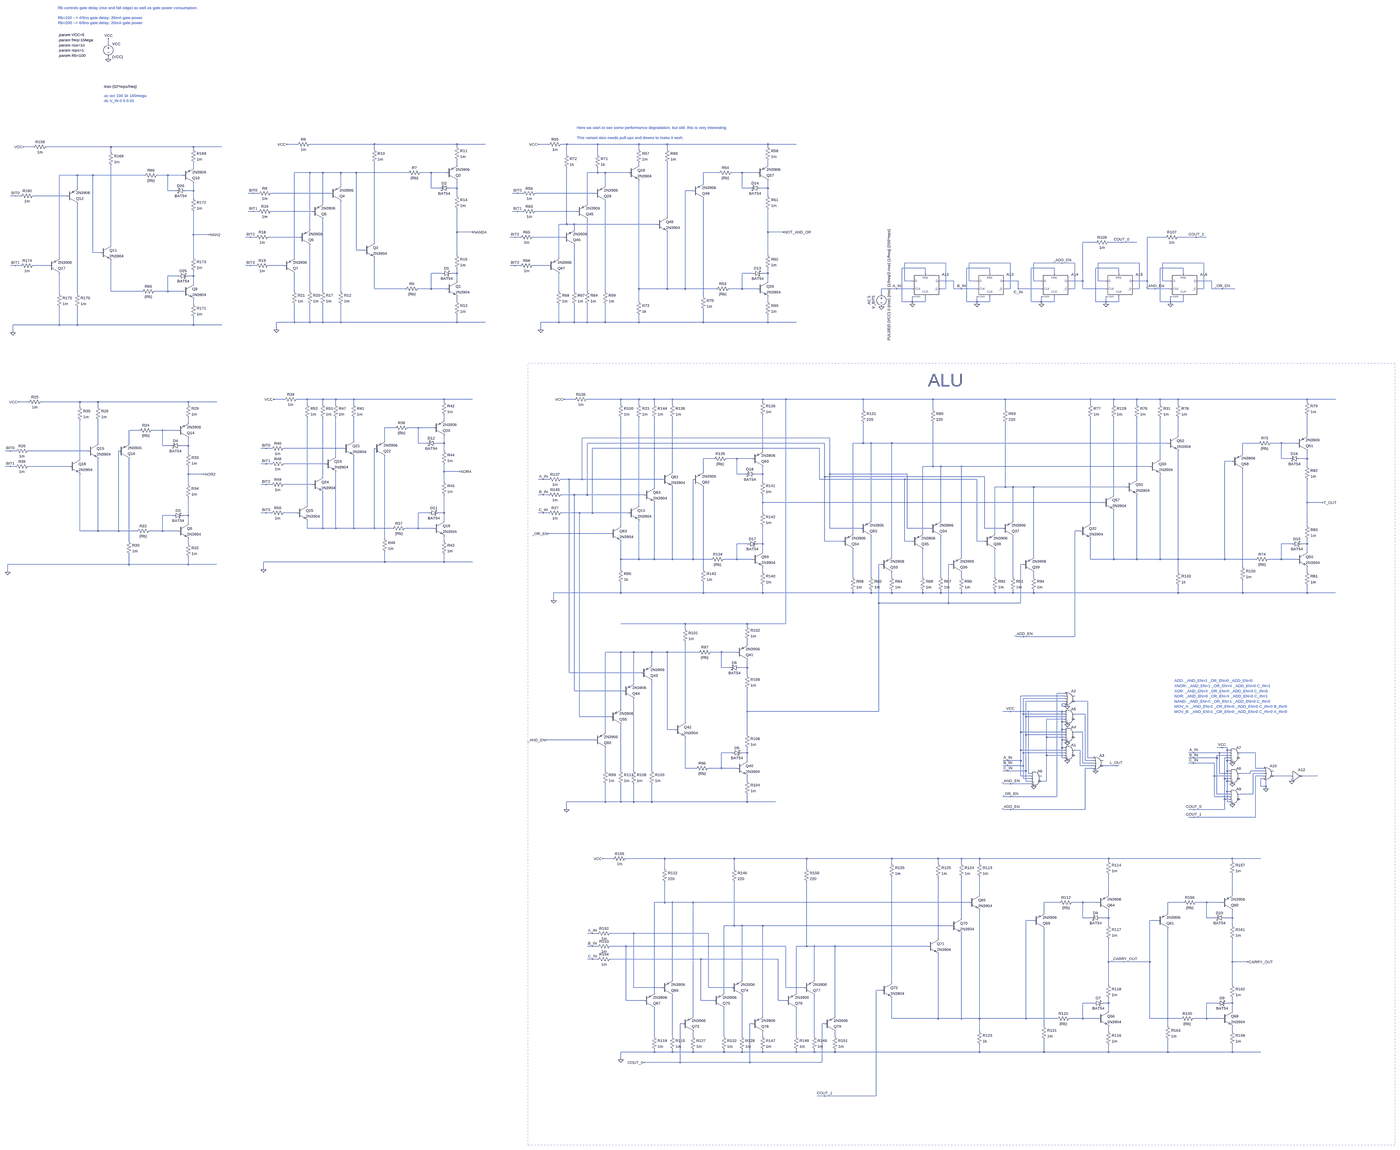
[diagram p0: schematic adder.asc, whole sheet]
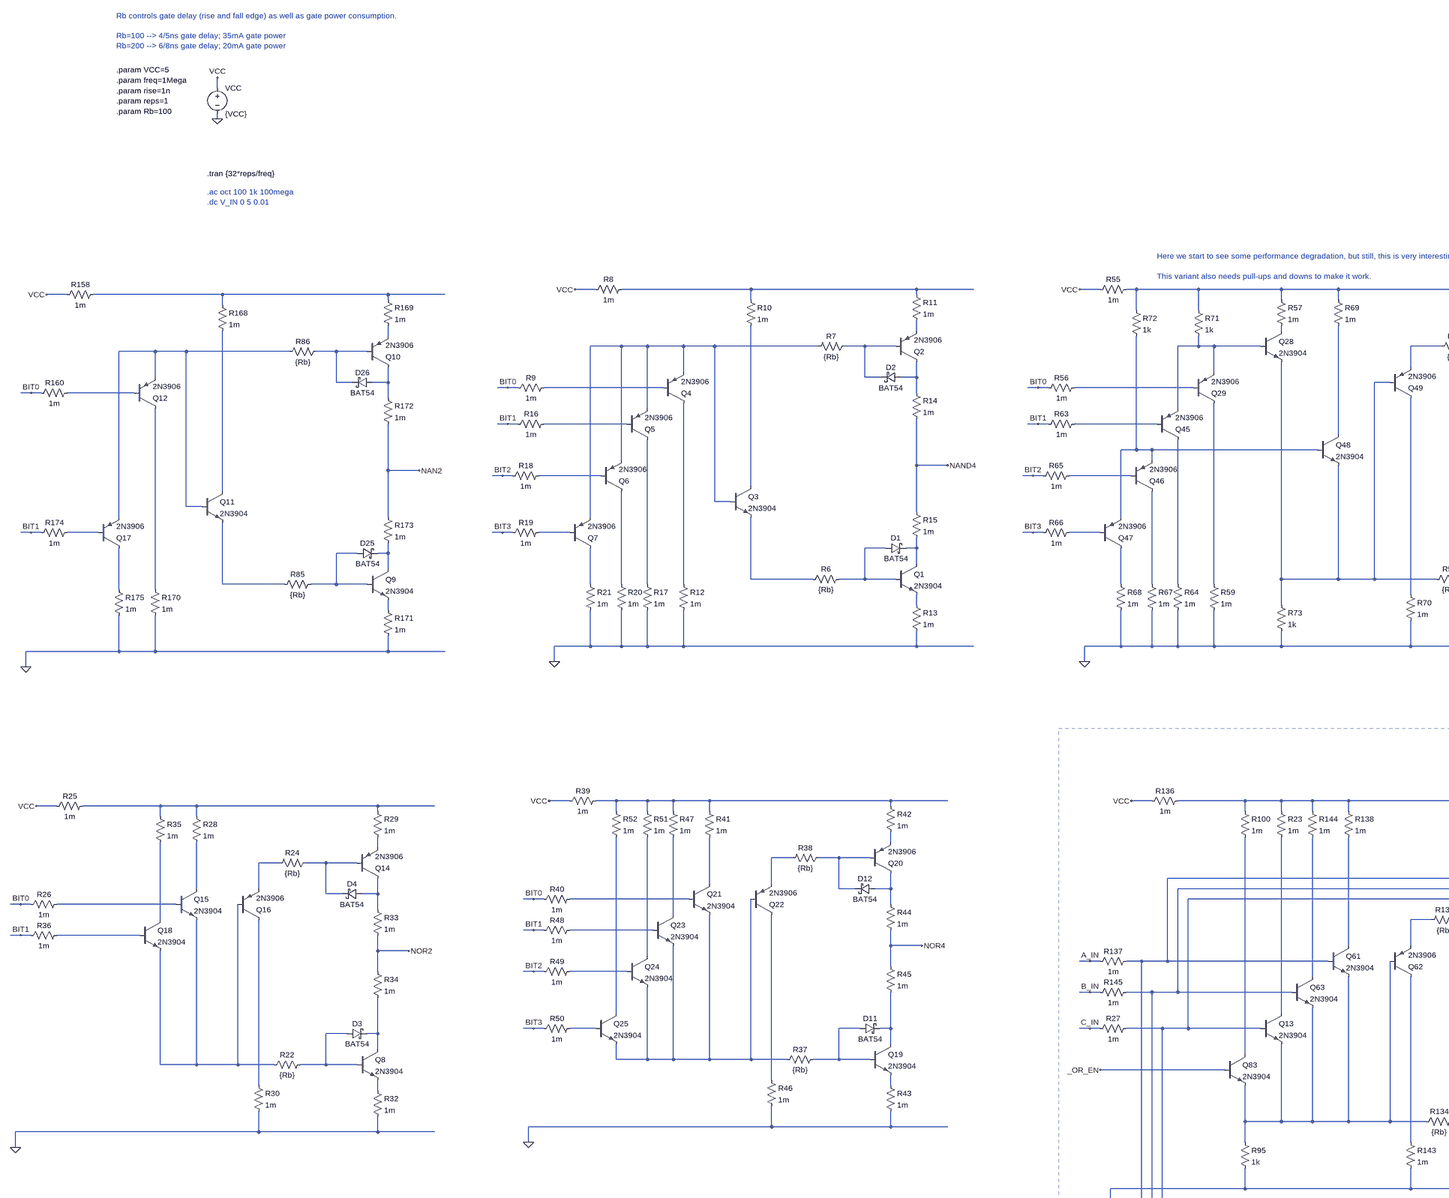
[diagram p1: schematic adder.asc, part, row 1 of 2, column 1 of 2]
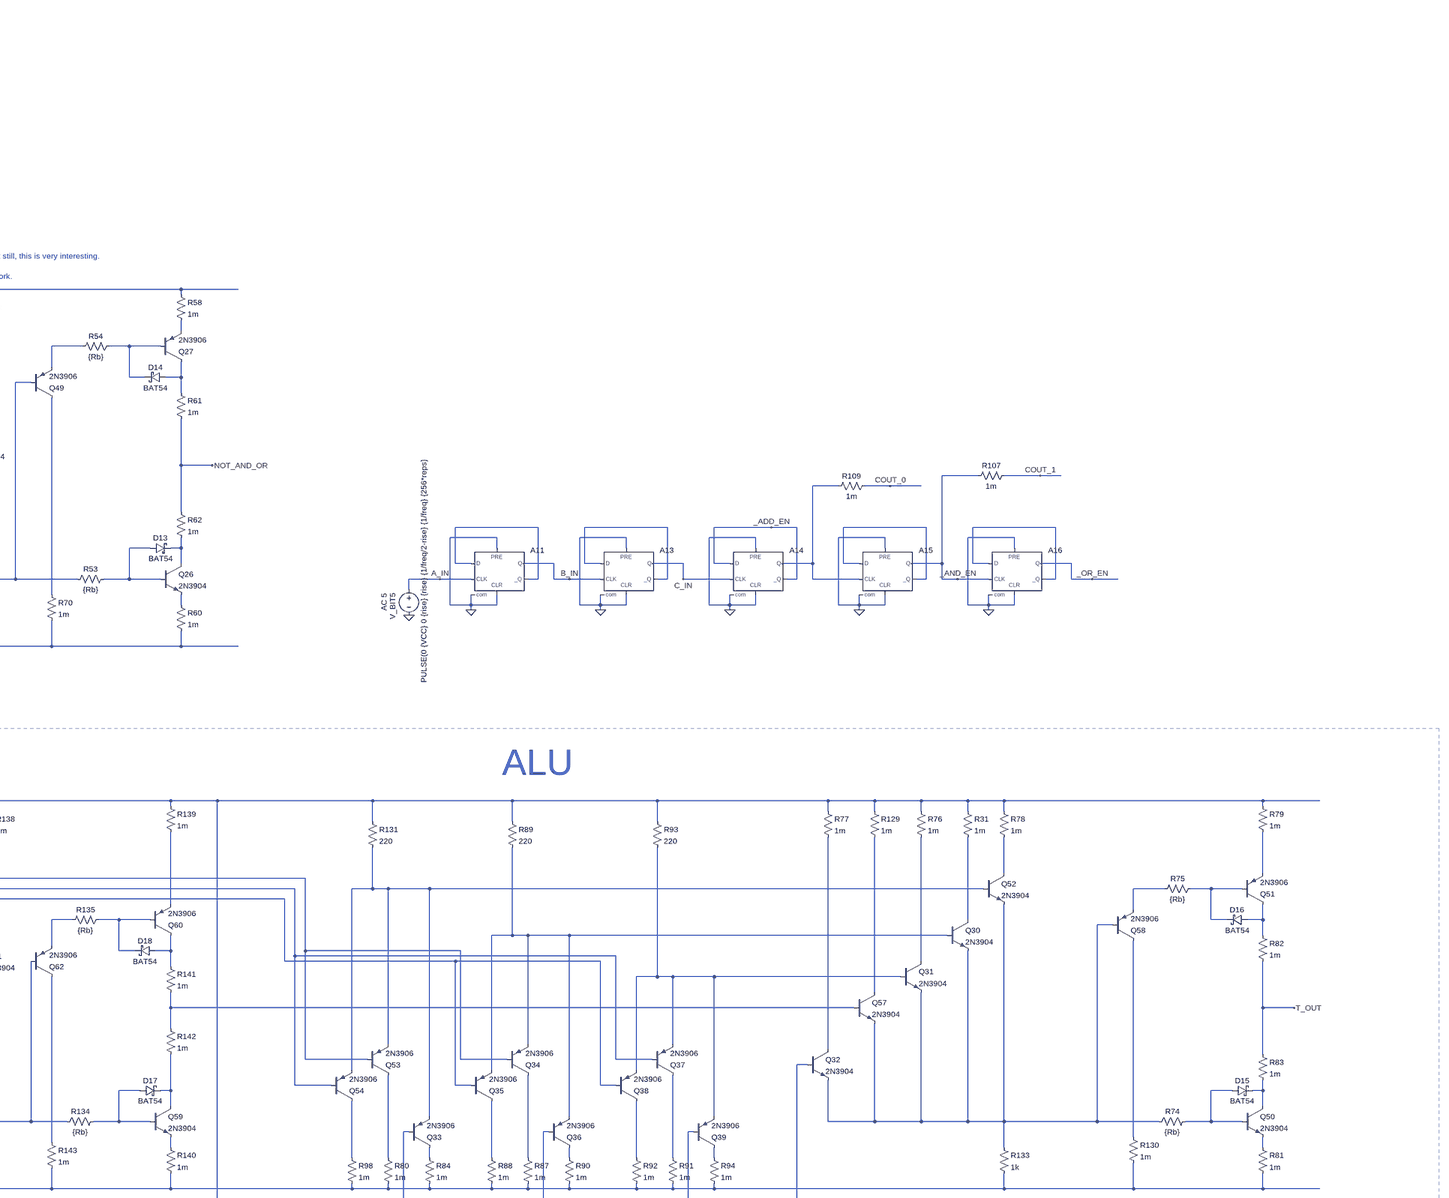
[diagram p2: schematic adder.asc, part, row 1 of 2, column 2 of 2]
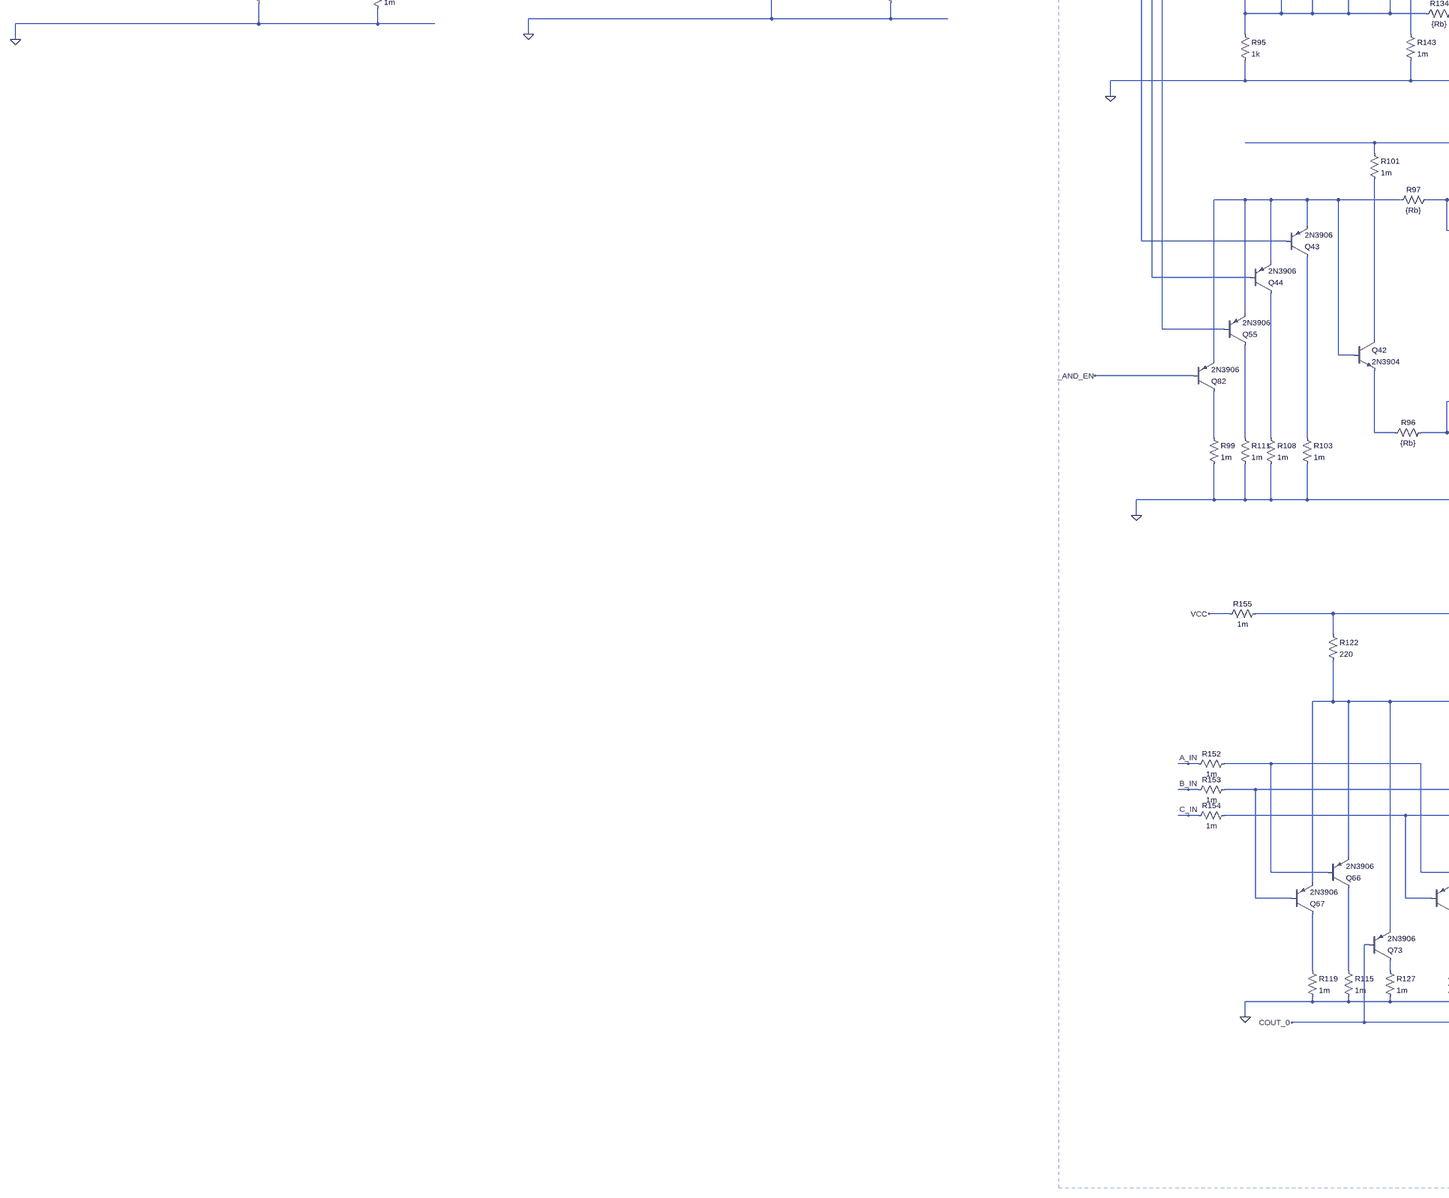
[diagram p3: schematic adder.asc, part, row 2 of 2, column 1 of 2]
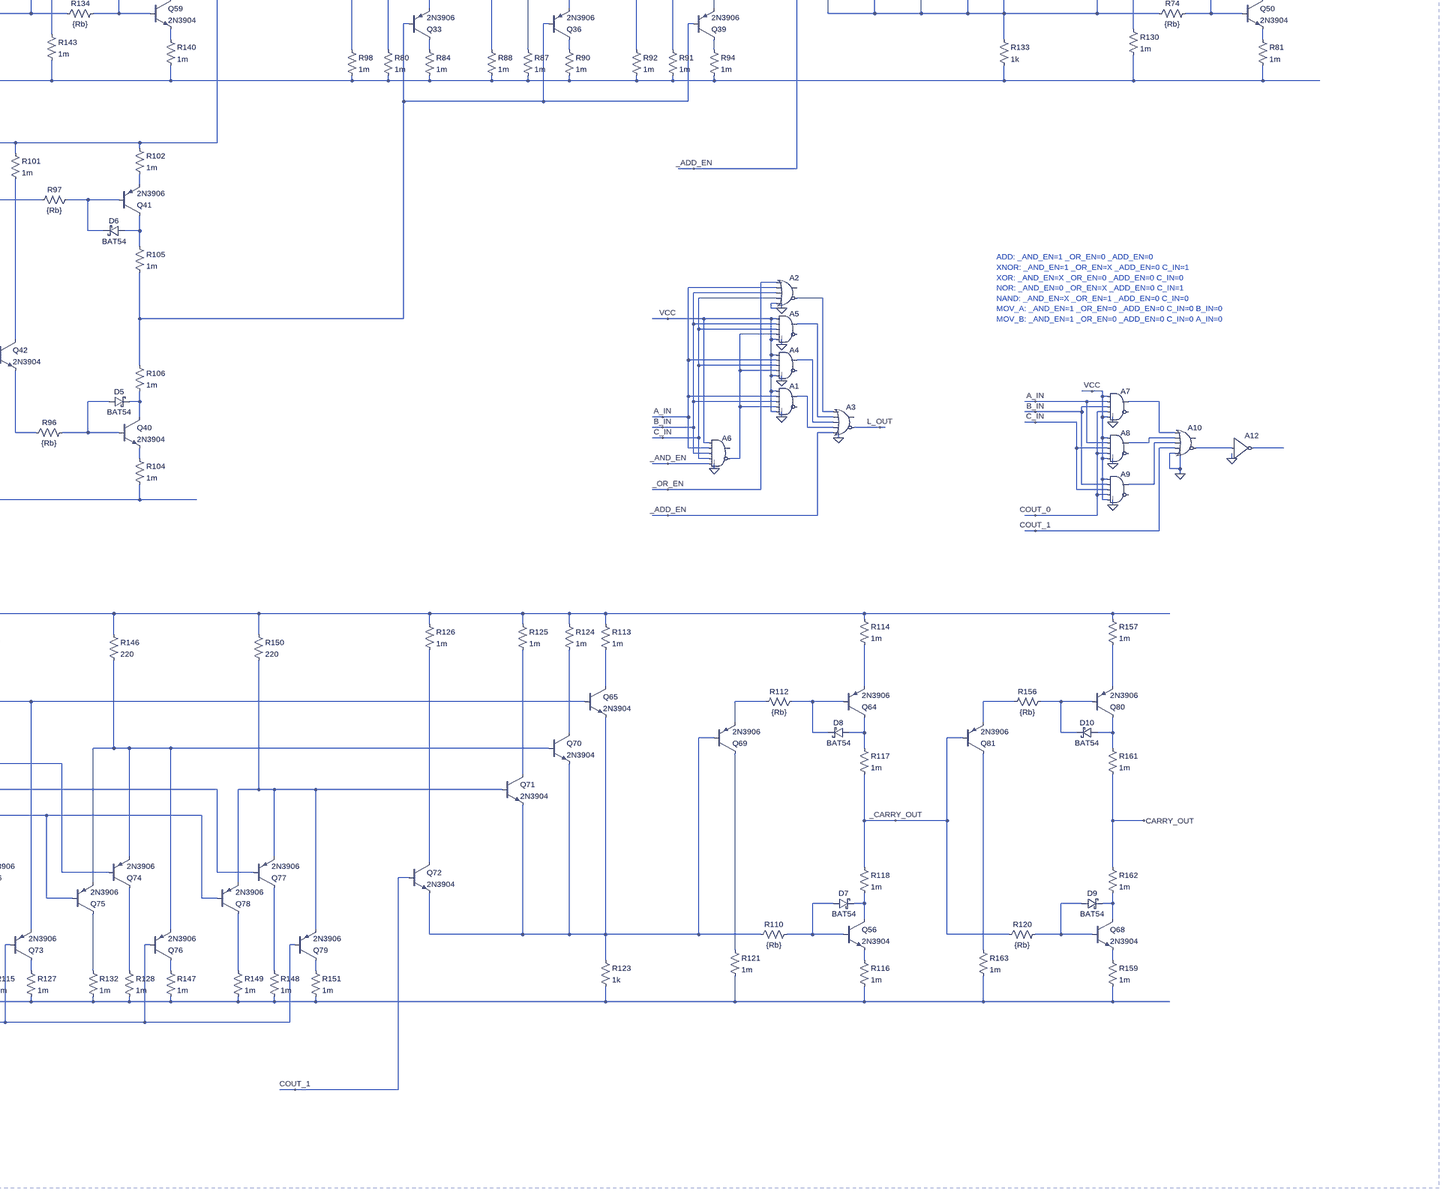
[diagram p4: schematic adder.asc, part, row 2 of 2, column 2 of 2]
* adder.asc
VCC VCC 0 {VCC}
R85 N045 N042 {Rb}
Q9 N043 N042 N059 0 2N3904
D25 N042 N043 BAT54
Q10 N017 N014 N007 0 2N3906
D26 N017 N014 BAT54
R86 N014 N013 {Rb}
R158 VCC N003 1m
R160 BIT0 N021 1m
Q11 N030 N013 N045 0 2N3904
Q12 N055 N021 N013 0 2N3906
R168 N003 N030 1m
R169 N003 N007 1m
R170 N055 0 1m
R171 N059 0 1m
R172 N017 NAN2 1m
R173 NAN2 N043 1m
Q17 N054 N035 N013 0 2N3906
R174 BIT1 N035 1m
R175 N054 0 1m
R6 N044 N038 {Rb}
Q1 N039 N038 N057 0 2N3904
D1 N038 N039 BAT54
Q2 N015 N009 N004 0 2N3906
D2 N015 N009 BAT54
R7 N009 N008 {Rb}
R8 VCC N001 1m
R9 BIT0 N019 1m
Q3 N028 N008 N044 0 2N3904
Q4 N049 N019 N008 0 2N3906
R10 N001 N028 1m
R11 N001 N004 1m
R12 N049 0 1m
R13 N057 0 1m
R14 N015 NAND4 1m
R15 NAND4 N039 1m
Q5 N048 N022 N008 0 2N3906
R16 BIT1 N022 1m
R17 N048 0 1m
Q6 N047 N026 N008 0 2N3906
R18 BIT2 N026 1m
Q7 N046 N036 N008 0 2N3906
R19 BIT3 N036 1m
R20 N047 0 1m
R21 N046 0 1m
R22 N113 N108 {Rb}
Q8 N109 N108 N117 0 2N3904
D3 N108 N109 BAT54
Q14 N079 N068 N064 0 2N3906
D4 N079 N068 BAT54
R24 N068 N067 {Rb}
R25 VCC N062 1m
R26 BIT0 N082 1m
Q15 N073 N082 N113 0 2N3904
Q16 N115 N113 N067 0 2N3906
R28 N062 N073 1m
R29 N062 N064 1m
R32 N117 0 1m
R33 N079 NOR2 1m
R34 NOR2 N109 1m
R30 N115 0 1m
Q18 N085 N092 N113 0 2N3904
R35 N062 N085 1m
R36 BIT1 N092 1m
R37 N112 N106 {Rb}
Q19 N107 N106 N116 0 2N3904
D11 N106 N107 BAT54
Q20 N074 N066 N063 0 2N3906
D12 N074 N066 BAT54
R38 N066 N065 {Rb}
R39 VCC N060 1m
R40 BIT0 N080 1m
Q21 N072 N080 N112 0 2N3904
Q22 N114 N112 N065 0 2N3906
R41 N060 N072 1m
R42 N060 N063 1m
R43 N116 0 1m
R44 N074 NOR4 1m
R45 NOR4 N107 1m
R46 N114 0 1m
Q23 N084 N091 N112 0 2N3904
R47 N060 N084 1m
R48 BIT1 N091 1m
Q24 N096 N098 N112 0 2N3904
R49 BIT2 N098 1m
Q25 N103 N105 N112 0 2N3904
R50 BIT3 N105 1m
R51 N060 N096 1m
R52 N060 N103 1m
R53 N018 N040 {Rb}
Q26 N041 N040 N058 0 2N3904
D13 N040 N041 BAT54
Q27 N016 N012 N006 0 2N3906
D14 N016 N012 BAT54
R54 N012 N011 {Rb}
R55 VCC N002 1m
R56 BIT0 N020 1m
Q28 N005 N010 N018 0 2N3904
Q29 N053 N020 N010 0 2N3906
R57 N002 N005 1m
R58 N002 N006 1m
R59 N053 0 1m
R60 N058 0 1m
R61 N016 NOT_AND_OR 1m
R62 NOT_AND_OR N041 1m
Q45 N052 N023 N010 0 2N3906
R63 BIT1 N023 1m
R64 N052 0 1m
Q46 N051 N027 N025 0 2N3906
R65 BIT2 N027 1m
Q47 N050 N037 N025 0 2N3906
R66 BIT3 N037 1m
R67 N051 0 1m
R68 N050 0 1m
R69 N002 N024 1m
Q48 N024 N025 N018 0 2N3904
Q49 N056 N018 N011 0 2N3906
R70 N056 0 1m
R71 N002 N010 1k
R72 N002 N025 1k
R73 N018 0 1k
R74 N090 N120 {Rb}
Q50 N121 N120 N127 0 2N3904
D15 N120 N121 BAT54
Q51 N089 N078 N070 0 2N3906
D16 N089 N078 BAT54
R75 N078 N077 {Rb}
Q52 N069 N076 N090 0 2N3904
Q53 N129 N071 N076 0 2N3906
R78 N061 N069 1m
R79 N061 N070 1m
R80 N129 0 1m
R81 N127 0 1m
R82 N089 T_OUT 1m
R83 T_OUT N121 1m
Q54 N128 N075 N076 0 2N3906
R98 N128 0 1m
R129 N061 N101 1m
Q57 N101 N102 N090 0 2N3904
Q58 N124 N090 N077 0 2N3906
R130 N124 0 1m
R131 N061 N076 220
R133 N090 0 1k
R134 N122 N118 {Rb}
Q59 N119 N118 N126 0 2N3904
D17 N118 N119 BAT54
Q60 N095 N087 N083 0 2N3906
D18 N095 N087 BAT54
R135 N087 N086 {Rb}
R136 VCC N061 1m
R137 A_IN N071 1m
Q61 N094 N071 N122 0 2N3904
Q62 N125 N122 N086 0 2N3906
R138 N061 N094 1m
R139 N061 N083 1m
R140 N126 0 1m
R141 N095 N102 1m
R142 N102 N119 1m
R143 N125 0 1m
Q63 N099 N075 N122 0 2N3904
R144 N061 N099 1m
R145 B_IN N075 1m
Q13 N104 N081 N122 0 2N3904
R23 N061 N104 1m
R27 C_IN N081 1m
Q30 N088 N093 N090 0 2N3904
Q31 N097 N100 N090 0 2N3904
Q32 N110 _ADD_EN N090 0 2N3904
R31 N061 N088 1m
R76 N061 N097 1m
R77 N061 N110 1m
Q33 N130 N123 N076 0 2N3906
R84 N130 0 1m
Q34 N132 N071 N093 0 2N3906
R87 N132 0 1m
Q35 N131 N081 N093 0 2N3906
R88 N131 0 1m
R89 N061 N093 220
Q36 N133 N123 N093 0 2N3906
R90 N133 0 1m
Q37 N135 N075 N100 0 2N3906
R91 N135 0 1m
Q38 N134 N081 N100 0 2N3906
R92 N134 0 1m
R93 N061 N100 220
Q39 N136 N123 N100 0 2N3906
R94 N136 0 1m
R95 N122 0 1k
R96 N150 N147 {Rb}
Q40 N148 N147 N159 0 2N3904
D5 N147 N148 BAT54
Q41 N140 N139 N137 0 2N3906
D6 N140 N139 BAT54
R97 N139 N138 {Rb}
Q42 N144 N138 N150 0 2N3904
Q43 N154 N071 N138 0 2N3906
R101 N061 N144 1m
R102 N061 N137 1m
R103 N154 0 1m
R104 N159 0 1m
R105 N140 N123 1m
R106 N123 N148 1m
Q44 N153 N075 N138 0 2N3906
R108 N153 0 1m
Q55 N152 N081 N138 0 2N3906
R111 N152 0 1m
R110 N172 N180 {Rb}
Q56 N181 N180 N186 0 2N3904
D7 N180 N181 BAT54
Q64 N170 N166 N162 0 2N3906
D8 N170 N166 BAT54
R112 N166 N165 {Rb}
Q65 N161 N164 N172 0 2N3904
Q66 N189 N174 N164 0 2N3906
R113 N160 N161 1m
R114 N160 N162 1m
R115 N189 0 1m
R116 N186 0 1m
R117 N170 _CARRY_OUT 1m
R118 _CARRY_OUT N181 1m
Q67 N188 N176 N164 0 2N3906
R119 N188 0 1m
Q69 N184 N172 N165 0 2N3906
R121 N184 0 1m
R122 N160 N164 220
R123 N172 0 1k
Q70 N169 N173 N172 0 2N3904
Q71 N175 N177 N172 0 2N3904
Q72 N179 COUT_1 N172 0 2N3904
R124 N160 N169 1m
R125 N160 N175 1m
R126 N160 N179 1m
Q73 N190 COUT_0 N164 0 2N3906
R127 N190 0 1m
Q74 N192 N174 N173 0 2N3906
R128 N192 0 1m
Q75 N191 N178 N173 0 2N3906
R132 N191 0 1m
R146 N160 N173 220
Q76 N193 COUT_0 N173 0 2N3906
R147 N193 0 1m
Q77 N195 N176 N177 0 2N3906
R148 N195 0 1m
Q78 N194 N178 N177 0 2N3906
R149 N194 0 1m
R150 N160 N177 220
Q79 N196 COUT_0 N177 0 2N3906
R151 N196 0 1m
R152 A_IN N174 1m
R153 B_IN N176 1m
R154 C_IN N178 1m
R155 VCC N160 1m
R120 _CARRY_OUT N182 {Rb}
Q68 N183 N182 N187 0 2N3904
D9 N182 N183 BAT54
Q80 N171 N168 N163 0 2N3906
D10 N171 N168 BAT54
R156 N168 N167 {Rb}
R157 N160 N163 1m
R159 N187 0 1m
R161 N171 CARRY_OUT 1m
R162 CARRY_OUT N183 1m
Q81 N185 _CARRY_OUT N167 0 2N3906
R163 N185 0 1m
A1 VCC A_IN B_IN N143 VCC 0 N146 0 AND Vhigh={VCC}
A3 N141 N142 N145 N146 _ADD_EN L_OUT 0 0 OR Vhigh={VCC}
A4 VCC A_IN C_IN N143 VCC 0 N145 0 AND Vhigh={VCC}
A5 VCC B_IN C_IN N143 VCC 0 N142 0 AND Vhigh={VCC}
A2 _OR_EN A_IN B_IN C_IN 0 N141 0 0 OR Vhigh={VCC}
A6 VCC A_IN B_IN C_IN _AND_EN N143 0 0 AND Vhigh={VCC}
A7 VCC A_IN B_IN COUT_0 VCC 0 N149 0 AND Vhigh={VCC}
A8 VCC A_IN C_IN COUT_0 VCC 0 N155 0 AND Vhigh={VCC}
A9 VCC B_IN C_IN COUT_0 VCC 0 N156 0 AND Vhigh={VCC}
A10 N149 N155 N156 COUT_1 0 N157 0 0 OR Vhigh={VCC}
A12 N157 0 0 0 0 N158 0 0 BUF Vhigh={VCC}
V_BIT5 A_IN 0 PULSE(0 {VCC} 0 {rise} {rise} {1/freq/2-rise} {1/freq} {256*reps}) AC 5
A11 N031 0 A_IN 0 0 N031 B_IN 0 DFLOP Vhigh={VCC}
A13 N032 0 B_IN 0 0 N032 C_IN 0 DFLOP Vhigh={VCC}
A15 N033 0 N029 0 0 N033 _AND_EN 0 DFLOP Vhigh={VCC}
A16 N034 0 _AND_EN 0 0 N034 _OR_EN 0 DFLOP Vhigh={VCC}
A14 _ADD_EN 0 C_IN 0 0 _ADD_EN N029 0 DFLOP Vhigh={VCC}
Q82 N151 _AND_EN N138 0 2N3906
R99 N151 0 1m
Q83 N111 _OR_EN N122 0 2N3904
R100 N061 N111 1m
R107 COUT_1 _AND_EN 1m
R109 COUT_0 N029 1m
.model D D
.lib standard.dio
.model NPN NPN
.model PNP PNP
.lib standard.bjt
.tran {32*reps/freq}
* .ac oct 100 1k 100mega
* .dc V_IN 0 5 0.01
.param VCC=5
.param freq=1Mega
.param rise=1n
.param reps=1
.param Rb=100
* Rb controls gate delay (rise and fall edge) as well as gate power consumption.
* Rb=100 --> 4/5ns gate delay; 35mA gate power
* Rb=200 --> 6/8ns gate delay; 20mA gate power
* Here we start to see some performance degradation, but still, this is very interesting.
* This variant also needs pull-ups and downs to make it work.
* ALU
* ADD: _AND_EN=1 _OR_EN=0 _ADD_EN=0
* XNOR: _AND_EN=1 _OR_EN=X _ADD_EN=0 C_IN=1
* XOR: _AND_EN=X _OR_EN=0 _ADD_EN=0 C_IN=0
* NOR: _AND_EN=0 _OR_EN=X _ADD_EN=0 C_IN=1
* NAND: _AND_EN=X _OR_EN=1 _ADD_EN=0 C_IN=0
* MOV_A: _AND_EN=1 _OR_EN=0 _ADD_EN=0 C_IN=0 B_IN=0
* MOV_B: _AND_EN=1 _OR_EN=0 _ADD_EN=0 C_IN=0 A_IN=0
.backanno
.end